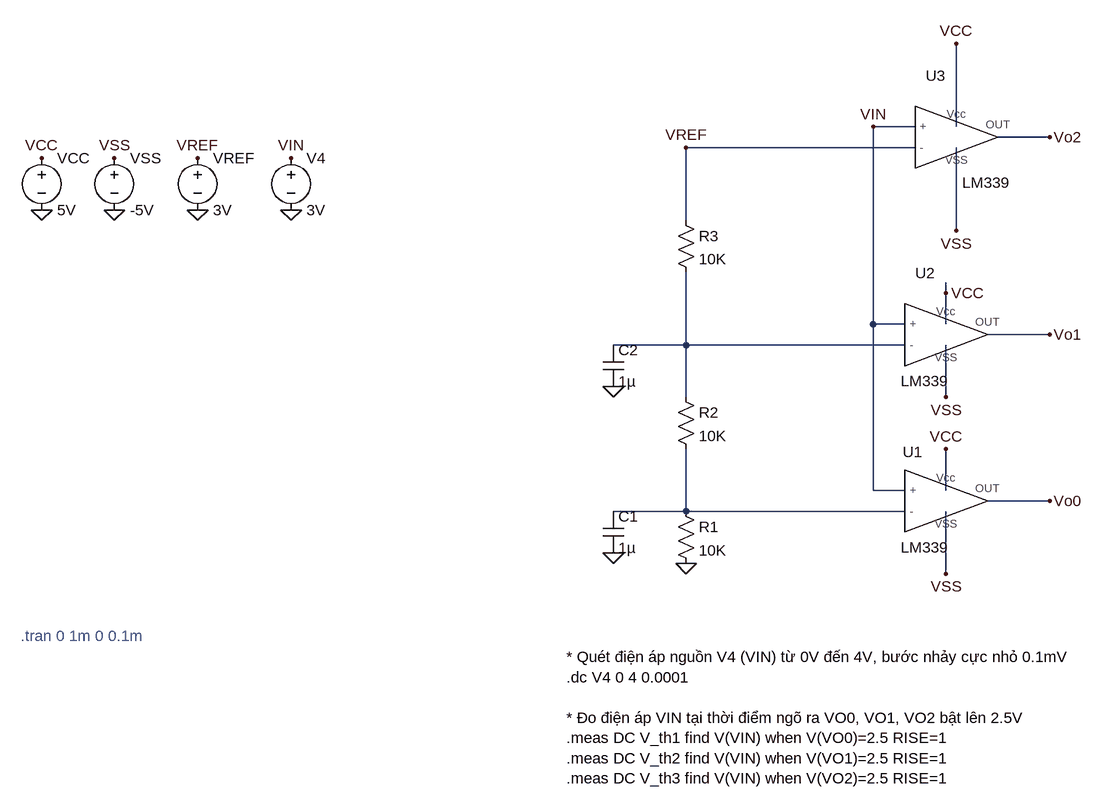
[diagram p0: schematic BAI 8 THUC HANH 3.asc]
BAI 8 THUC HANH 3.asc, the LTspice schematic file:
Version 4.1
SHEET 1 880 1236
WIRE 192 112 128 112
WIRE 256 112 256 -16
WIRE 400 128 320 128
WIRE 192 144 -160 144
WIRE -160 256 -160 144
WIRE 256 272 256 144
WIRE 240 368 240 352
WIRE 128 416 128 112
WIRE 176 416 128 416
WIRE 240 416 240 368
WIRE 400 432 304 432
WIRE -160 448 -160 336
WIRE -160 448 -272 448
WIRE 176 448 -160 448
WIRE -160 528 -160 448
WIRE 240 528 240 448
WIRE 128 672 128 416
WIRE 176 672 128 672
WIRE 240 672 240 608
WIRE 400 688 304 688
WIRE -160 704 -160 608
WIRE -160 704 -272 704
WIRE 176 704 -160 704
WIRE 240 800 240 704
FLAG 256 -16 VCC
FLAG 256 272 VSS
FLAG 240 368 VCC
FLAG 240 528 VSS
FLAG 240 608 VCC
FLAG 240 800 VSS
FLAG -160 144 VREF
FLAG -272 512 0
FLAG -160 784 0
FLAG -272 768 0
FLAG -912 240 0
FLAG -1040 240 0
FLAG -1152 240 0
FLAG -1152 160 VCC
FLAG -1040 160 VSS
FLAG -912 160 VREF
FLAG -768 160 VIN
FLAG -768 240 0
FLAG 128 112 VIN
FLAG 400 688 Vo0
FLAG 400 432 Vo1
FLAG 400 128 Vo2
SYMBOL LM339 224 128 R0
WINDOW 3 78 54 Top 2
SYMATTR InstName U3
SYMBOL LM339 208 432 R0
SYMATTR InstName U2
SYMBOL LM339 208 688 R0
WINDOW 0 -19 -60 Bottom 2
SYMATTR InstName U1
SYMBOL res -176 240 R0
SYMATTR InstName R3
SYMATTR Value 10K
SYMBOL cap -288 448 R0
SYMATTR InstName C2
SYMATTR Value 1µ
SYMBOL res -176 512 R0
SYMATTR InstName R2
SYMATTR Value 10K
SYMBOL res -176 688 R0
SYMATTR InstName R1
SYMATTR Value 10K
SYMBOL cap -288 704 R0
SYMATTR InstName C1
SYMATTR Value 1µ
SYMBOL voltage -1152 144 R0
SYMATTR InstName VCC
SYMATTR Value 5V
SYMBOL voltage -1040 144 R0
SYMATTR InstName VSS
SYMATTR Value -5V
SYMBOL voltage -912 144 R0
SYMATTR InstName VREF
SYMATTR Value 3V
SYMBOL voltage -768 144 R0
SYMATTR InstName V4
SYMATTR Value 3V
TEXT -1184 896 Left 2 ;.tran 0 1m 0 0.1m
TEXT -344 928 Left 2 !* Quét điện áp nguồn V4 (VIN) từ 0V đến 4V, bước nhảy cực nhỏ 0.1mV\n.dc V4 0 4 0.0001\n \n* Đo điện áp VIN tại thời điểm ngõ ra VO0, VO1, VO2 bật lên 2.5V\n.meas DC V_th1 find V(VIN) when V(VO0)=2.5 RISE=1\n.meas DC V_th2 find V(VIN) when V(VO1)=2.5 RISE=1\n.meas DC V_th3 find V(VIN) when V(VO2)=2.5 RISE=1

The netlist it stands for:
* BAI 8 THUC HANH 3.asc
X§U3 VIN VREF VCC VSS Vo2 LM339  ; pins + - Vcc VSS OUT
X§U2 VIN N001 VCC VSS Vo1 LM339  ; pins + - Vcc VSS OUT
X§U1 VIN N002 VCC VSS Vo0 LM339  ; pins + - Vcc VSS OUT
R3 VREF N001 10K
C2 N001 0 1µ
R2 N001 N002 10K
R1 N002 0 10K
C1 N002 0 1µ
VCC VCC 0 5V
VSS VSS 0 -5V
VREF VREF 0 3V
V4 VIN 0 3V
* .tran 0 1m 0 0.1m
* Quét điện áp nguồn V4 (VIN) từ 0V đến 4V, bước nhảy cực nhỏ 0.1mV
.dc V4 0 4 0.0001
* Đo điện áp VIN tại thời điểm ngõ ra VO0, VO1, VO2 bật lên 2.5V
.meas DC V_th1 find V(VIN) when V(VO0)=2.5 RISE=1
.meas DC V_th2 find V(VIN) when V(VO1)=2.5 RISE=1
.meas DC V_th3 find V(VIN) when V(VO2)=2.5 RISE=1
.lib E:\ThiThucHanhCoHa\CoHa\LM339.cir
.backanno
.end